# EAGLE schematic CHI_laser_cond_1 (EAGLE 9.6.2)
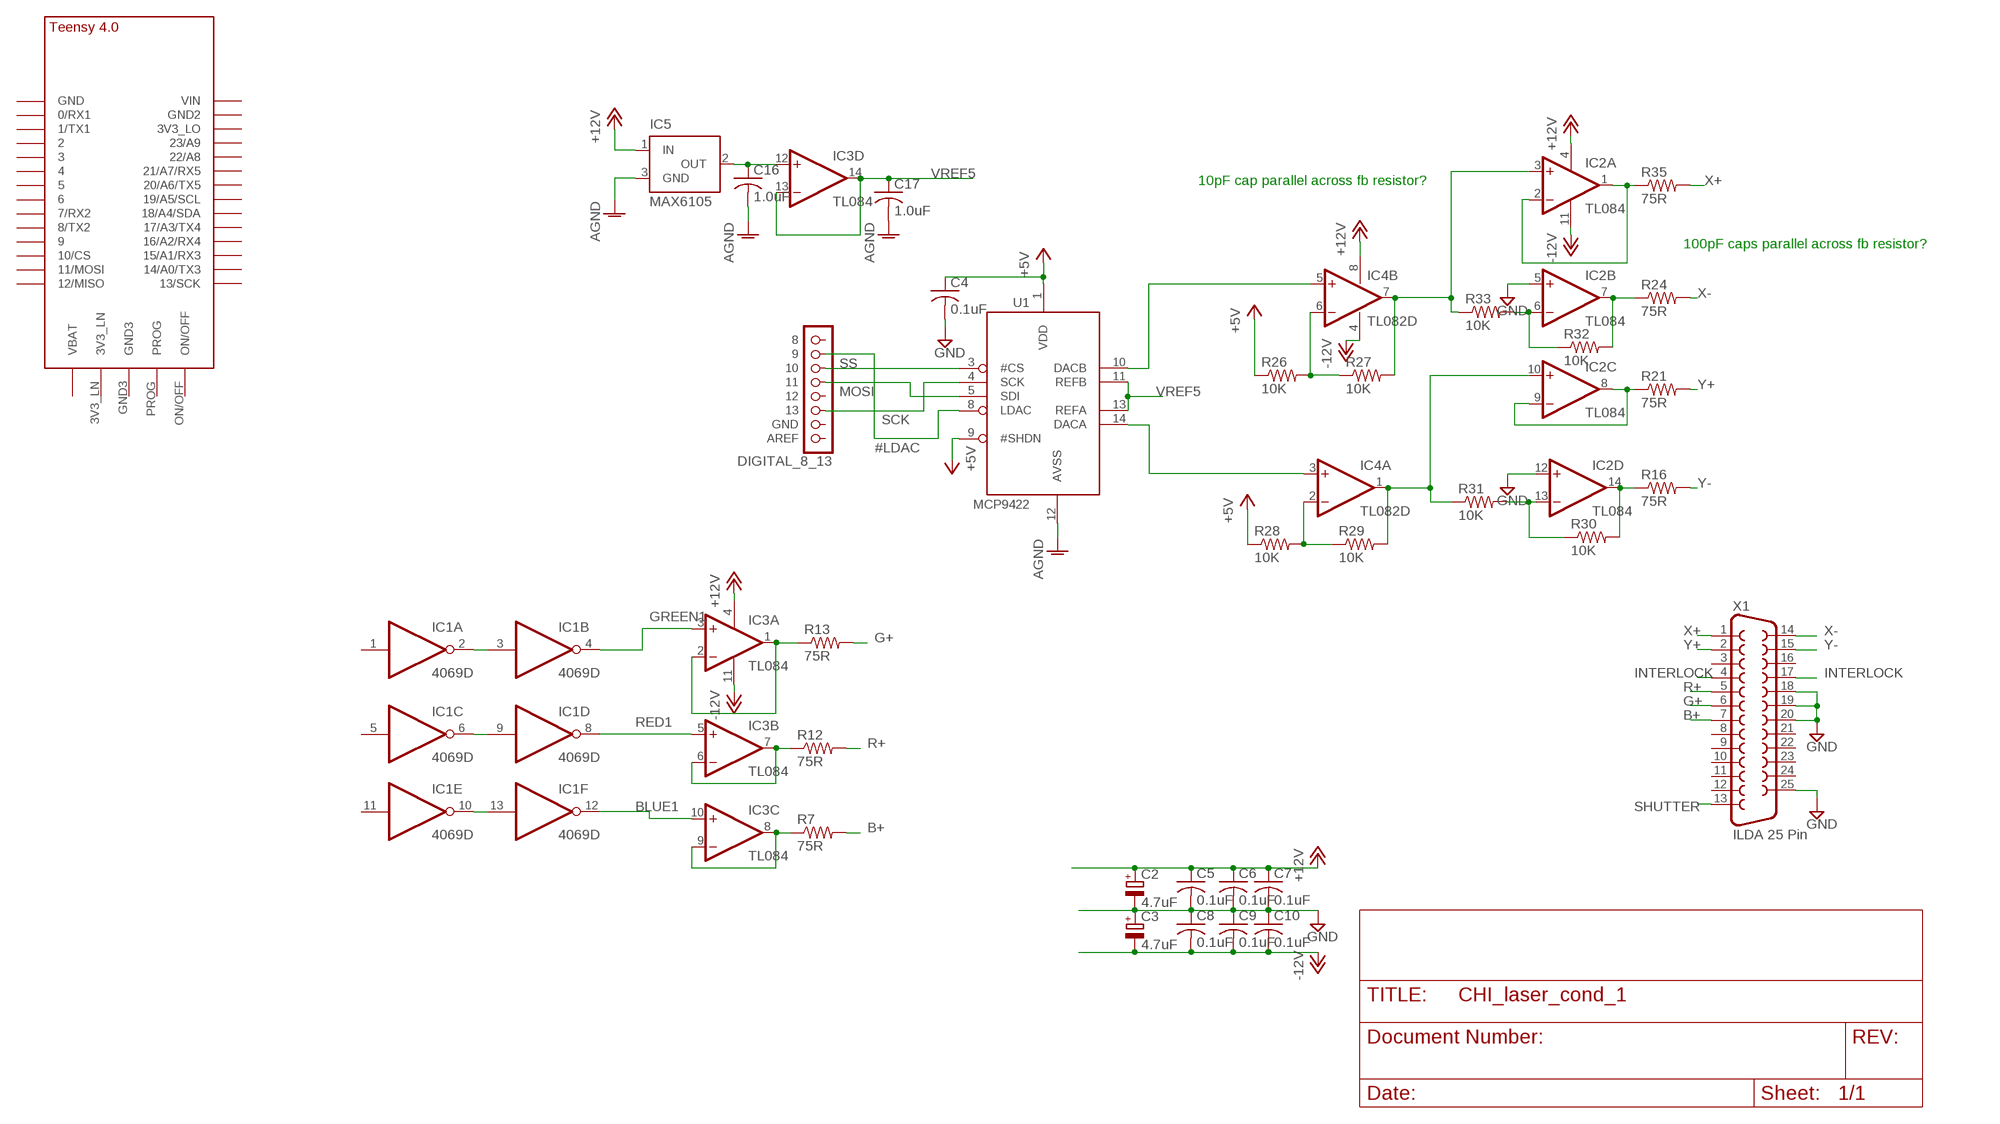
[diagram p0: schematic, sheet 1]

## Parts
C2  4.7uF  CPOL-EUE1.8-4  [E1,8-4]
C3  4.7uF  CPOL-EUE1.8-4  [E1,8-4]
C4  0.1uF  C-USC0603  [C0603]
C5  0.1uF  C-USC0603  [C0603]
C6  0.1uF  C-USC0603  [C0603]
C7  0.1uF  C-USC0603  [C0603]
C8  0.1uF  C-USC0603  [C0603]
C9  0.1uF  C-USC0603  [C0603]
C10  0.1uF  C-USC0603  [C0603]
C16  1.0uF  C-US025-024X044  [C025-024X044]
C17  1.0uF  C-US025-024X044  [C025-024X044]
IC1  4069D  [SO14]
IC2  TL084  [SOIC-14]
IC3  TL084  [SOIC-14]
IC4  TL082D  [SO08]
IC5  MAX6105  MAX6520  [SOT23]
R7  75R  R-US_R0603  [R0603]
R12  75R  R-US_R0603  [R0603]
R13  75R  R-US_R0603  [R0603]
R16  75R  R-US_R0603  [R0603]
R21  75R  R-US_R0603  [R0603]
R24  75R  R-US_R0603  [R0603]
R26  10K  R-US_R0603  [R0603]
R27  10K  R-US_R0603  [R0603]
R28  10K  R-US_R0603  [R0603]
R29  10K  R-US_R0603  [R0603]
R30  10K  R-US_R0603  [R0603]
R31  10K  R-US_R0603  [R0603]
R32  10K  R-US_R0603  [R0603]
R33  10K  R-US_R0603  [R0603]
R35  75R  R-US_R0603  [R0603]
U1  MCP4922  [SOIC-14]
U$1  TEENSY_4.0  [TEENSY_4.0]
U$4  DIGITAL_8_13  [1X08]
X1  ILDA 25 Pin  F25D  [F25D]

## Nets
#LDAC: U1.8(LDAC) U$4.7
+5V: C4.1 R26.1 R28.1 U1.1(VDD) U1.9(#SHDN)
+12V: C2.+ C5.1 C6.1 C7.1 IC2.4(A:V+) IC3.4(A:V+) IC4.8(P:V+) IC5.1(IN)
-12V: C3.- C8.2 C9.2 C10.2 IC2.11(A:V-) IC3.11(A:V-) IC4.4(P:V-)
AGND: C16.2 C17.2 IC5.3(GND) U1.12(AVSS)
B1+: IC3.8(C:OUT) IC3.9(C:-IN) R7.1
B+: R7.2 X1.7
BLUE1: IC1.12(F:O) IC3.10(C:+IN)
G1+: IC3.1(A:OUT) IC3.2(A:-IN) R13.1
G+: R13.2 X1.6
GND: C2.- C3.+ C4.2 C5.2 C6.2 C7.2 C8.1 C9.1 C10.1 IC2.5(B:+IN) IC2.12(D:+IN) X1.18 X1.19 X1.20 X1.25
GREEN1: IC1.4(B:O) IC3.3(A:+IN)
INTERLOCK: X1.4 X1.17
MOSI: U1.5(SDI) U$4.5
N$1: IC1.2(A:O) IC1.3(B:I)
N$2: IC1.6(C:O) IC1.9(D:I)
N$3: IC1.10(E:O) IC1.13(F:I)
N$24: IC4.5(B:+IN) U1.10(DACB)
N$25: C16.1 IC3.12(D:+IN) IC5.2(OUT)
N$30: IC4.6(B:-IN) R26.2 R27.1
N$31: IC4.2(A:-IN) R28.2 R29.1
N$33: IC4.3(A:+IN) U1.14(DACA)
N$35: IC2.6(B:-IN) R32.1 R33.2
N$36: IC2.13(D:-IN) R30.1 R31.2
R1+: IC3.6(B:-IN) IC3.7(B:OUT) R12.1
R+: R12.2 X1.5
RED1: IC1.8(D:O) IC3.5(B:+IN)
SCK: U1.4(SCK) U$4.3
SHUTTER: X1.13
SS: U1.3(#CS) U$4.6
VREF5: C17.1 IC3.13(D:-IN) IC3.14(D:OUT) U1.11(REFB) U1.13(REFA)
X1+: IC2.1(A:OUT) IC2.2(A:-IN) R35.1
X1-: IC2.7(B:OUT) R24.1 R32.2
X2: IC2.10(C:+IN) IC4.1(A:OUT) R29.2 R31.1
X+: R35.2 X1.1
X-: R24.2 X1.14
Y1+: IC2.8(C:OUT) IC2.9(C:-IN) R21.1
Y1-: IC2.14(D:OUT) R16.1 R30.2
Y2: IC2.3(A:+IN) IC4.7(B:OUT) R27.2 R33.1
Y+: R21.2 X1.2
Y-: R16.2 X1.15
Unconnected: IC1.1(A:I) IC1.5(C:I) IC1.11(E:I) U$1.0/RX(0/RX1) U$1.1/TX(1/TX1) U$1.2 U$1.3/CANTX U$1.3V3_LN U$1.3V3_LO U$1.4/CANRX U$1.5 U$1.6 U$1.7(7/RX2) U$1.8(8/TX2) U$1.9/CS U$1.10/CS U$1.11/MOSI U$1.12/MISO U$1.13/SCK U$1.14/A0(14/A0/TX3) U$1.15/A1(15/A1/RX3) U$1.16/A2(16/A2/RX4) U$1.17/A3(17/A3/TX4) U$1.18/A4/SDA U$1.19/A5/SCL U$1.20/A6(20/A6/TX5) U$1.21/A7(21/A7/RX5) U$1.22/A8 U$1.23/A9 U$1.GND U$1.GND2 U$1.GND3 U$1.ON/OFF U$1.PROG U$1.VBAT\(VBAT) U$1.VIN U$4.1(AREF) U$4.2(GND) U$4.4 U$4.8 X1.3 X1.8 X1.9 X1.10 X1.11 X1.12 X1.16 X1.21 X1.22 X1.23 X1.24

## Notes on the sheet
- 10pF cap parallel across fb resistor?
- 100pF caps parallel across fb resistor?

## Power pins joined to a net without a drawn wire
VDD: IC1.14(P:VDD)
VSS: IC1.7(P:VSS)

## Library data of the parts
C2 C3 = rcl:CPOL-EU: POLARIZED CAPACITOR, European symbol
C4-C10 C16 C17 = adafruit:C-US: CAPACITOR, American symbol
IC1 = 40xx:4069: Hex INVERTER
IC2 IC3 = favreau:TL084: Texas Instruments TL084 JFET General Purpose Op-Amp
IC4 = linear:TL082: OP AMP
IC5 = maxim:MAX6520: 1.2V Voltage Reference 50ppm/°C, SOT23, 3-Terminal Source: http://datasheets.maxim-ic.com/en/ds/MAX6520.pdf
R7 R12 R13 R16 R21 R24 R26-R33 R35 = resistor:R-US_: RESISTOR, American symbol
U1 = favreau:MCP4922
U$1 = TEENSY 4.0:TEENSY_4.0
U$4 = arduino:DIGITAL_8_13
X1 = SparkFun:F25: D-SUB 25 25 Pin male connector. PCB edge mount for regular PCB thicknesses. This connector will connect directly to the back of a PC parallel port or through a normal DB25 extension cable (M/F). SKU: PRT-08287